# EAGLE design shield 1 axis (EAGLE 7.6.0)
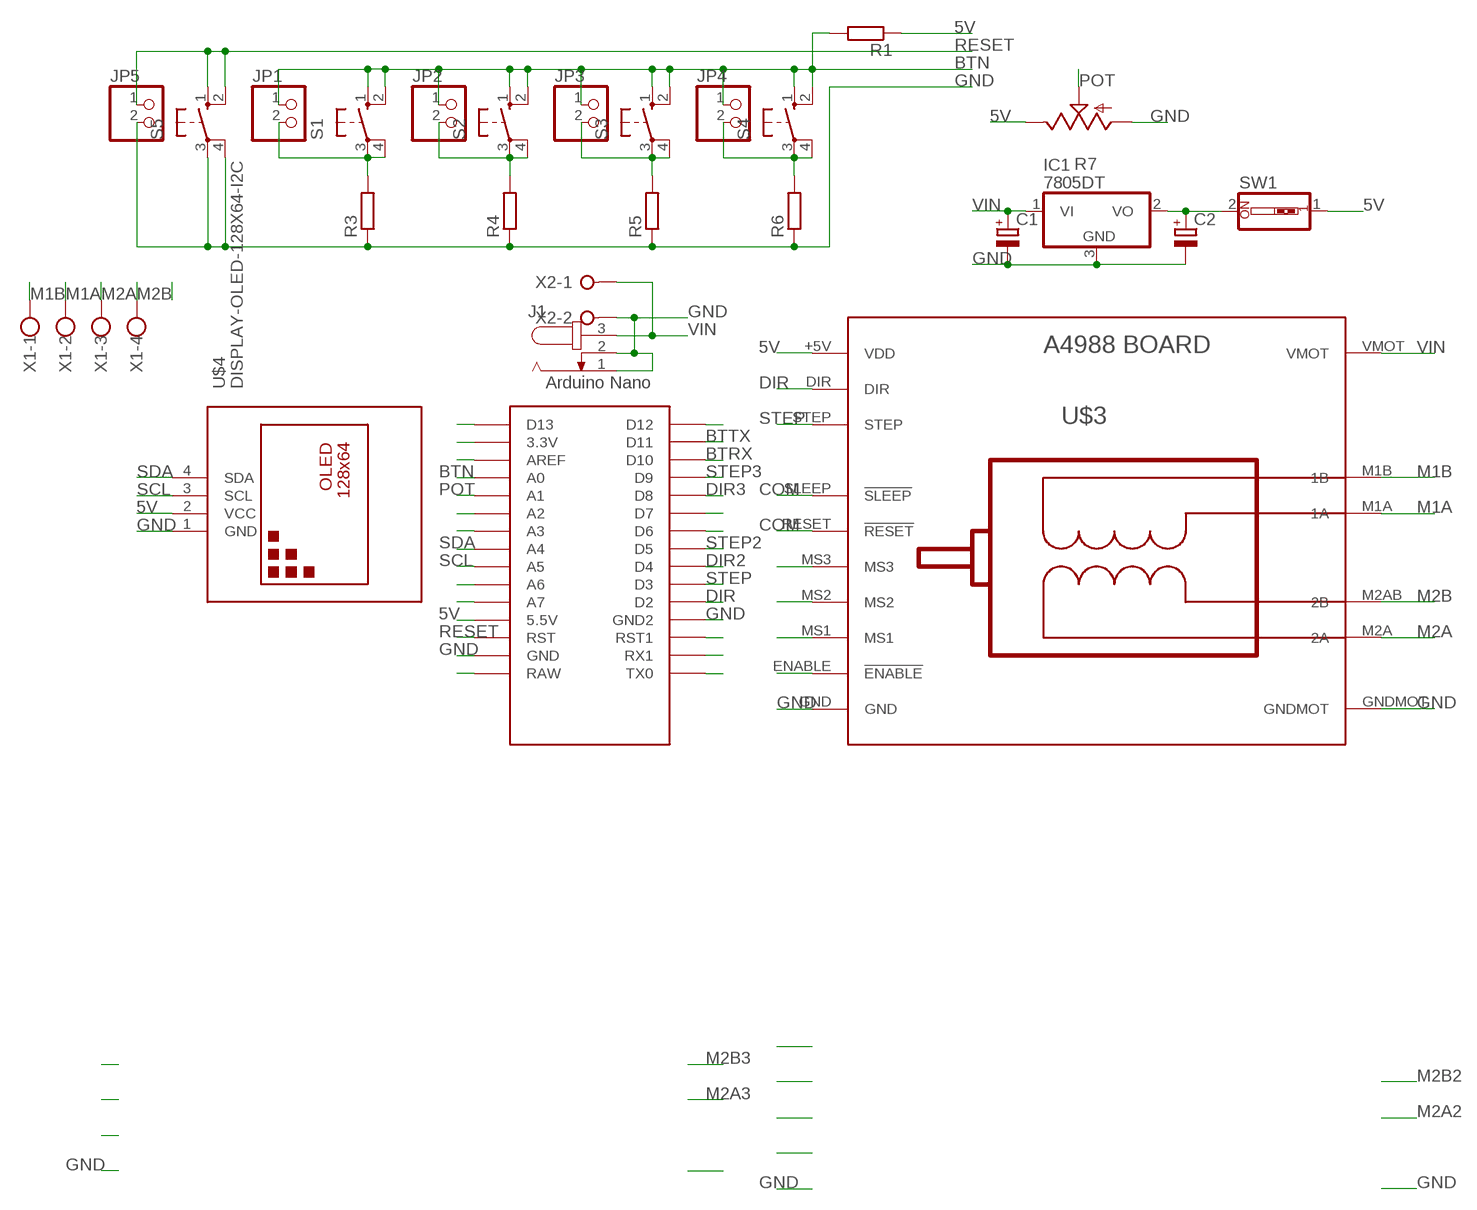
[diagram p0: schematic, sheet 1]

## Parts
C1  CPOL-EUE2.5-7  [E2,5-7]
C2  CPOL-EUE2.5-7  [E2,5-7]
IC1  7805DT  [TO252]
J1  JACK-PLUG1  [SPC4078]
JP1  PINHD-1X2  [1X02]
JP2  PINHD-1X2  [1X02]
JP3  PINHD-1X2  [1X02]
JP4  PINHD-1X2  [1X02]
JP5  PINHD-1X2  [1X02]
R1  R-EU_R1206  [R1206]
R3  R-EU_R1206  [R1206]
R4  R-EU_R1206  [R1206]
R5  R-EU_R1206  [R1206]
R6  R-EU_R1206  [R1206]
R7  TRIM_US-S63S  [S63S]
S1  40-XX  [B3F-40XX]
S2  40-XX  [B3F-40XX]
S3  40-XX  [B3F-40XX]
S4  40-XX  [B3F-40XX]
S5  10-XX  [B3F-10XX]
SW1  SW_DIP-1  [EDG-01]
U$1  NANO  [NANO]
U$3  BOARD_A4988  [BOARD_A4988]
U$4  DISPLAY-OLED-128X64-I2C  [DISPLAY-OLED-128X64-I2C]
X1  W237-4  [W237-4]
X2  W237-02P  [W237-132]

## Nets
5V: R1.1 R7.E SW1.1 U$1.5V(5.5V) U$3.+5V(VDD) U$4.2(VCC)
BTN: JP1.1 JP2.1 JP3.1 JP4.1 R1.2 S1.1(S) S1.2(S1) S2.1(S) S2.2(S1) S3.1(S) S3.2(S1) S4.1(S) S4.2(S1) U$1.A0
BTN1: JP4.2 R6.2 S4.3(P) S4.4(P1)
BTN2: JP3.2 R5.2 S3.3(P) S3.4(P1)
BTN3: JP2.2 R4.2 S2.3(P) S2.4(P1)
BTN4: JP1.2 R3.2 S1.3(P) S1.4(P1)
BTRX: U$1.D10
BTTX: U$1.D11
COM: U$3.RESET(!RESET) U$3.SLEEP(!SLEEP)
DIR: U$1.D2 U$3.DIR
DIR2: U$1.D4
DIR3: U$1.D8
GND: C1.- C2.- IC1.3(GND) J1.1 J1.2 JP5.2 R3.1 R4.1 R5.1 R6.1 R7.A S5.3(P) S5.4(P1) U$1.GND U$1.GND1(GND2) U$3.GND U$3.GNDMOT U$4.1(GND) X2.2
M1A: U$3.M1A(1A) X1.2
M1B: U$3.M1B(1B) X1.1
M2A: U$3.M2A(2A) X1.3
M2B: U$3.M2AB(2B) X1.4
N$4: U$1.D12
N$7: U$1.D6
N$10: U$1.RST1
N$11: U$1.TX0
N$14: U$1.A6
N$16: U$1.A2
N$18: U$1.3.3V
N$19: U$1.D13
N$25: U$3.MS2
N$26: U$3.ENABLE(!ENABLE)
N$42: U$1.AREF
N$44: U$1.A3
N$46: U$1.A7
N$48: U$1.RAW
N$49: U$1.RX1
N$53: U$1.D7
N$56: U$3.MS3
N$57: U$3.MS1
N$59: C2.+ IC1.2(VO) SW1.2
POT: R7.S U$1.A1
RESET: JP5.1 S5.1(S) S5.2(S1) U$1.RST
SCL: U$1.A5 U$4.3(SCL)
SDA: U$1.A4 U$4.4(SDA)
STEP: U$1.D3 U$3.STEP
STEP2: U$1.D5
STEP3: U$1.D9
VIN: C1.+ IC1.1(VI) J1.3 U$3.VMOT X2.1
Unconnected: U$1.ICSP1 U$1.ICSP2 U$1.ICSP3 U$1.ICSP4 U$1.ICSP5 U$1.ICSP6

## Library data of the parts
C1 C2 = Clean-Kong:CPOL-EU: POLARIZED CAPACITOR, European symbol
IC1 = adafruit:78*: Positive VOLTAGE REGULATOR Added bigger pads to the TO-92 package
J1 = con-jack:JACK-PLUG: DC POWER JACK Power Jack, DC, Right Angle, Through Hole, Rated 5A at 16VDC, PC Terminals Distributor: Farnell (www.Farnell.de) Drawing: 84N1161.pdf / 84N1162.pdf Manufacturer: SPC Technology (www.spctechnology.com) Type: SPC4077 / SPC 4078; OC_FARNELL: unknown; OC_NEWARK: unknown
JP1-JP5 = pinhead:PINHD-1X2: PIN HEADER
R1 R3-R6 = Clean-Kong:R-EU_: RESISTOR, European symbol
R7 = pot:TRIM_US-: POTENTIOMETER
S1-S4 = adafruit:40-XX: OMRON SWITCH; MF: OMRON COMPONENTS USA; MPN: B3F-4000; OC_FARNELL: 176434; OC_NEWARK: 36K3105
S5 = switch-omron:10-XX: OMRON SWITCH; MPN: B3F-1000; OC_FARNELL: 176432; OC_NEWARK: 36M3542
SW1 = special:SW_DIP-1: DIP SWITCH
U$1 = Arduino-clone:NANO: Arduino Nano
U$3 = Clean-Kong:BOARD_A4988
U$4 = diy-modules:DISPLAY-OLED-128X64-I2C: 128x64 Dot Matrix OLED Module based on SSD1306 chip Variant with I2C interface More details available here: http://www.instructables.com/id/Monochrome-096-i2c-OLED-display-with-arduino-SSD13/ SSD1306 datasheet: https://cdn-shop.adafruit.com/datasheets/SSD1306.pdf Click here to find device on ebay.com <http://www.ebay.com/sch/oled+display+128x64+iic> Note: There are two variants: I2C and SPI. Search for the proper version.
X1 = con-wago-500:W237-4: WAGO SCREW CLAMP; OC_FARNELL: unknown; OC_NEWARK: unknown
X2 = con-wago-508:W237-02P: WAGO SREW CLAMP; OC_FARNELL: unknown; OC_NEWARK: unknown

## Board
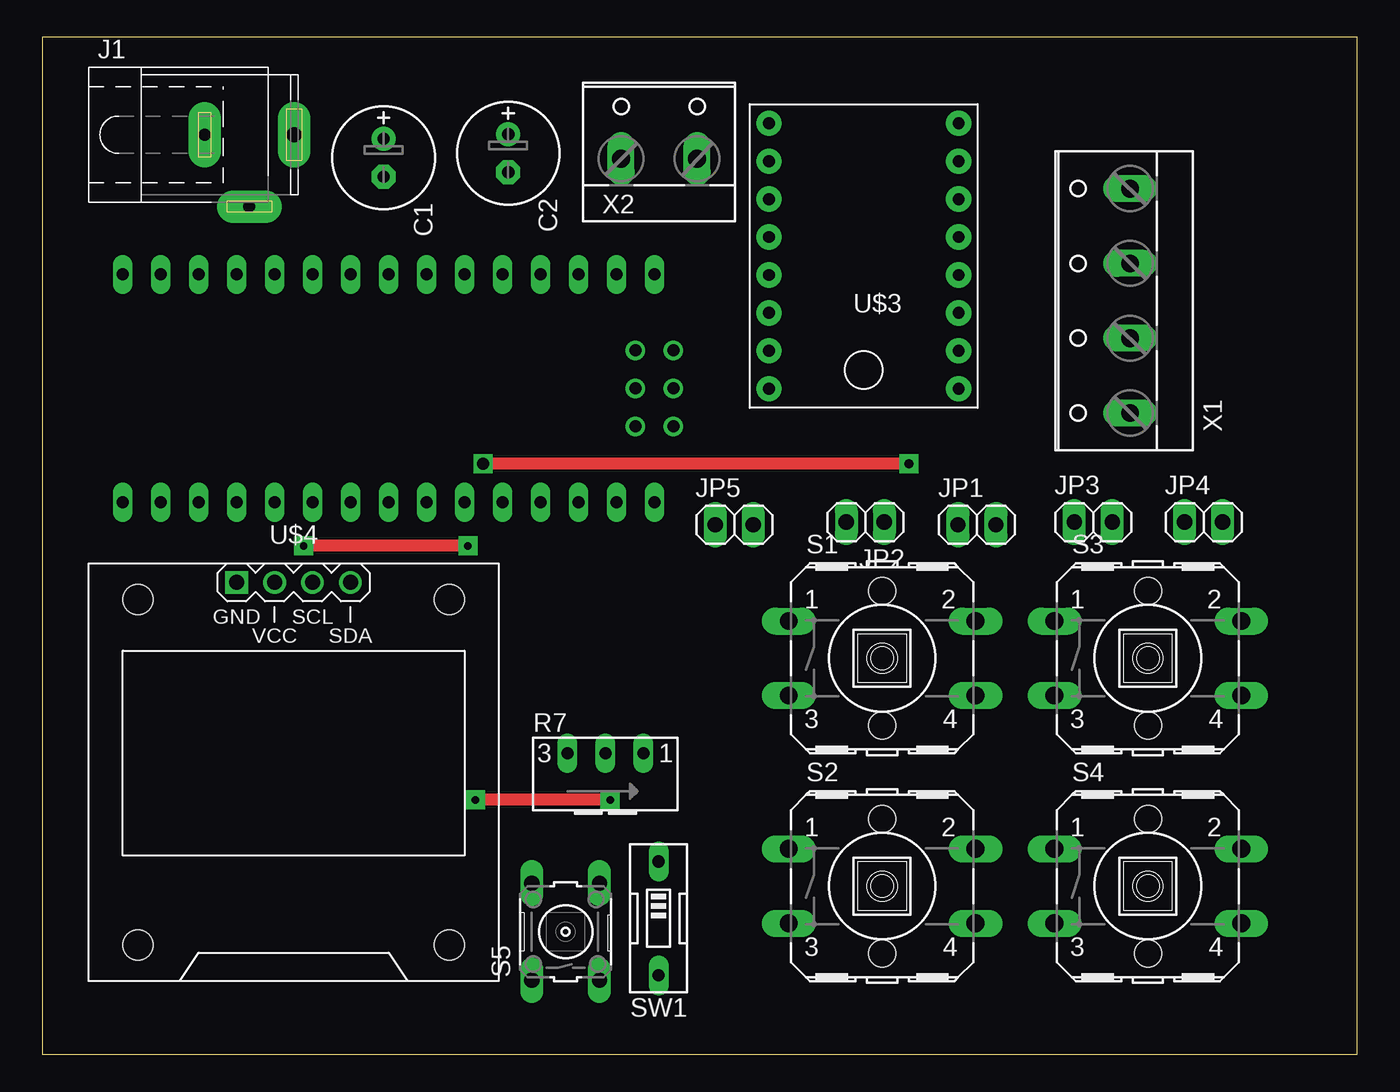
[diagram p1: board, top side]
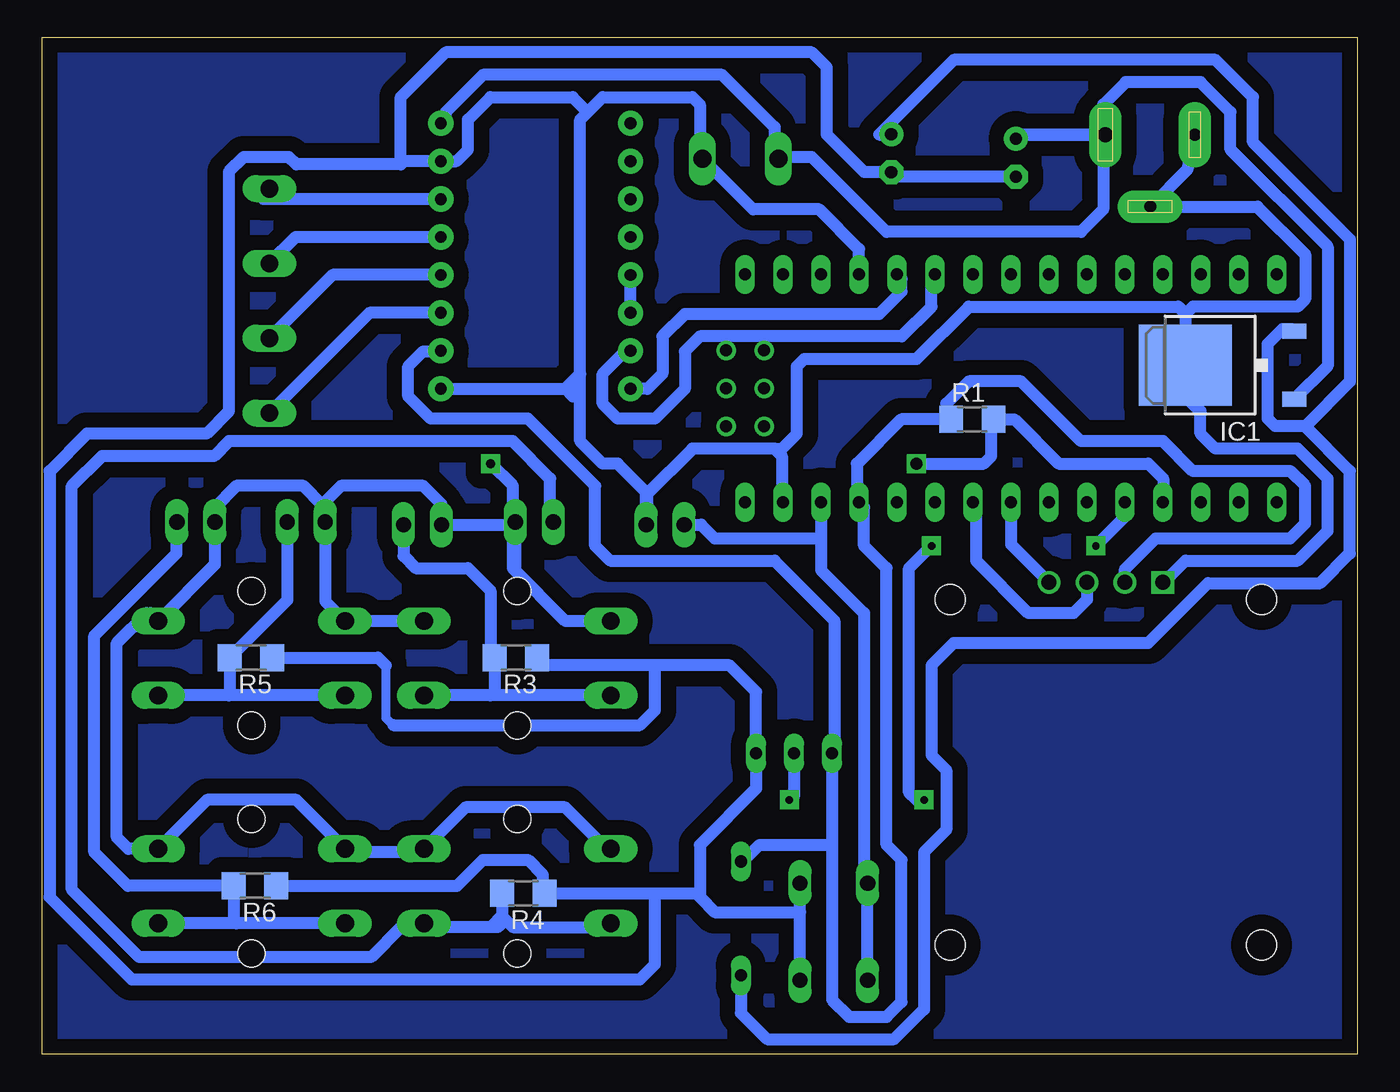
[diagram p2: board, bottom side, seen from below]

Size 88 x 68 mm. Coordinates in mm from the lower left corner, seen from the top.
Outline: 0,0 88,0 88,68 0,68 0,0
Copper layers (1*16): Top 0.035mm / dielectric 1.5mm / Bottom 0.035mm
Design rules "default": minimum track width 10mil, minimum drill 24mil, track to track 8mil, track to pad 8mil, pad to pad 8mil, via to via 8mil, smd to smd 8mil, copper to edge 40mil, drill to drill 8mil, minimum pad ring 10mil, minimum via ring 8mil, stop-mask expansion 4mil, vias tented up to drill 0mil, thermal gap 10mil

### Footprints (pad centres in the part's own frame; a part is rotated, then mirrored left to right if it is on the bottom)
E2,5-7 = drill 0.813 pad 1.6: + -1.27,0 | drill 0.813 pad 1.6 octagon: - 1.27,0
TO252 = smd 1 x 1.6: 1 -2.28,-4.8; 2 2.28,-4.8 | smd 5.4 x 6.2: 3 0,2.5
SPC4078 = drill 0.8 pad 2.184 long: 1 -3,0; 2 0,-4.8 | drill 1 pad 2.184 long: 3 3,0
1X02 = drill 1.016 long: 1 -1.27,0; 2 1.27,0
R1206 = smd 1.6 x 1.803: 1 -1.422,0; 2 1.422,0
S63S = drill 0.813 long: A 2.54,1.27; E -2.54,1.27; S 0,1.27
B3F-40XX = drill 1.194 long: 1 -6.248,2.489; 2 6.248,2.489; 3 -6.248,-2.489; 4 6.248,-2.489 | hole 1.803: 0,-4.496; 0,4.496
B3F-10XX = drill 1.016 long: 1 -3.251,2.261; 2 3.251,2.261; 3 -3.251,-2.261; 4 3.251,-2.261
EDG-01 = drill 0.813 long: 1 0,-3.81; 2 0,3.81
NANO = drill 0.8 long: 3.3V -10.16,24.13; 5V -10.16,-1.27; A0 -10.16,19.05; A1 -10.16,16.51; A2 -10.16,13.97; A3 -10.16,11.43; A4 -10.16,8.89; A5 -10.16,6.35; A6 -10.16,3.81; A7 -10.16,1.27; AREF -10.16,21.59; D2 5.08,1.27; D3 5.08,3.81; D4 5.08,6.35; D5 5.08,8.89; D6 5.08,11.43; D7 5.08,13.97; D8 5.08,16.51; D9 5.08,19.05; D10 5.08,21.59; D11 5.08,24.13; D12 5.08,26.67; D13 -10.16,26.67; GND -10.16,-6.35; GND1 5.08,-1.27; RAW -10.16,-8.89; RST -10.16,-3.81; RST1 5.08,-3.81; RX1 5.08,-6.35; TX0 5.08,-8.89 | drill 0.8: ICSP1 -5.08,-10.16; ICSP2 -5.08,-7.62; ICSP3 -2.54,-10.16; ICSP4 -2.54,-7.62; ICSP5 0,-10.16; ICSP6 0,-7.62
BOARD_A4988 = drill 0.8 pad 1.676: +5V 1.27,16.51; DIR 13.97,19.05; ENABLE 13.97,1.27; GND 1.27,19.05; GNDMOT 1.27,3.81; M1A 1.27,11.43; M1B 1.27,13.97; M2A 1.27,8.89; M2AB 1.27,6.35; MS1 13.97,3.81; MS2 13.97,6.35; MS3 13.97,8.89; RESET 13.97,11.43; SLEEP 13.97,13.97; STEP 13.97,16.51; VMOT 1.27,1.27
DISPLAY-OLED-128X64-I2C = drill 1 square: 1 -3.81,12.7 | drill 1: 2 -1.27,12.7; 3 1.27,12.7; 4 3.81,12.7 | hole 2: -10.414,11.557; 10.414,11.557; 10.414,-11.557; -10.414,-11.557
W237-4 = drill 1.194 long: 1 -7.5,-1.27; 2 -2.5,-1.27; 3 2.5,-1.27; 4 7.5,-1.27
W237-132 = drill 1.194 long: 1 -2.54,-0.635; 2 2.54,-0.635

### Placement (x,y rotation side)
C1  22.85,59.96 270 top
C2  31.19,60.26 270 top
IC1  9.02,46.08 90 bottom
J1  13.87,61.49 0 top
JP1  62.55,35.41 0 top
JP2  55.07,35.59 180 top
JP3  70.33,35.59 0 top
JP4  77.71,35.59 0 top
JP5  46.31,35.41 0 top
R1  25.76,42.46 0 bottom
R3  56.3,26.52 180 bottom
R4  55.8,10.76 180 bottom
R5  74.02,26.52 180 bottom
R6  73.75,11.26 180 bottom
R7  37.69,18.86 0 top
S1  56.2,26.48 0 top
S2  56.2,11.24 0 top
S3  73.98,26.48 0 top
S4  73.98,11.24 0 top
S5  35.03,8.19 90 top
SW1  41.25,9.08 180 top
U$1  32.07,47.07 90 top
U$3  62.59,63.54 180 top
U$4  16.83,18.86 0 top
X1  71.52,50.38 90 top
X2  41.28,60.52 0 top

### Tracks (layer width: path | path; a pad name or v marks a point on that pad's centre or on a via)
5V
  Bottom 0.813: U$4.2 15.56,32.44 13.5,34.5 4.5,34.5 3.5,35.5 3.5,38 4.5,39 11,39 13,41 18.5,41 22.5,45 26,45 27.5,43.5 27.5,42.78 R1.1 30.54,42.46 33.5,39.5 33.5,37.07 U$1.5V 33,36.57 33,34 31.5,32.5 31.5,14 30.5,13 30.5,3.5 31.5,2.5 34,2.5 35.15,3.65 35.15,14 | R7.E 35.15,18.99 | R7.E 35.15,14 | R7.E 35,20.28 35,29 39,33 50,33 51,34 51,38 55.5,42.5 62,42.5 63.5,44 63.5,46 62.5,47 61.35,47 U$3.+5V | SW1.1 41.11,12.89 40,14 35.15,14
BTN  (via drill 0.5 pad 1.27, 0.6, 0.8)
  Top 0.813: v58,39.5 v29.5,39.5
  Bottom 0.813: U$1.A0 13,36.93 13,38.5 14,39.5 20,39.5 22.96,42.46 R1.2 24.5,42.3 24.5,40 25,39.5 v29.5,39.5 | JP4.1 76.44,35 | 76.44,35 76.44,32.76 S3.2 80.76,29.5 81,29.5 83,27.5 83,14.5 82.23,13.73 S4.2 76.96,17 71,17 S4.1 67.5,13.5 63,13.5 62.77,13.73 S2.2 59.68,16.5 53,16.5 50.23,13.73 S2.1 | S3.1 69.06,30.3 JP3.1 69.06,36.56 69.25,36.75 | 69.25,36.75 70.5,38 75,38 76.5,36.5 76.5,35.06 76.44,35 | S1.2 S3.1 | 68.5,29 68.47,28.97 S3.1 | 69.25,36.75 68,38 62.5,38 61.28,36.78 JP1.1 56.52,35.41 JP2.1 56.34,32.34 53,29 49.98,29 S1.1 52.97,28.97 56.5,32.5 56.5,38 v58,39.5
BTN1
  Bottom 0.813: S4.3 75,8.75 | 75,8.75 S4.4 | 75,8.75 75.17,8.92 R6.2 82.26,11.26 84.5,13.5 84.5,28 79,33.5 79,35.57 JP4.2
BTN2
  Bottom 0.813: JP3.2 71.6,30.36 R5.2 75.44,24.05 75.5,23.99 | S3.3 75.5,23.99 | 75.5,23.99 S3.4
BTN3
  Bottom 0.813: R4.2 57.22,9.28 58,8.5 | 58,8.5 62.7,8.5 | 62.7,8.5 S2.4 | R4.2 57.22,9.22 56.5,8.5 49.7,8.5 | 49.5,8.5 49.7,8.5 | 49.7,8.5 S2.3 | R4.2 57.22,8.78 57.5,8.5 58,8.5 | 62.7,8.5 64,8.5 66,6.5 81.5,6.5 86,11 86,38 84,40 76.5,40 75.5,41 56.5,41 54,38.5 54,35.79 JP2.2
BTN4
  Bottom 0.813: S1.3 58,23.99 | 58,23.99 S1.4 | 58,23.99 57.72,24.27 R3.2 58,26.8 58,31 59.5,32.5 63,32.5 63.82,33.32 JP1.2
COM
  Bottom 0.813: U$3.SLEEP U$3.RESET
DIR
  Bottom 0.813: U$1.D2 30.5,51.85 30.5,51 32,49.5 45,49.5 46.5,48 46.5,45.5 47.5,44.5 U$3.DIR
GND
  Bottom 0.61: 65,26 65,22.5 64.5,22
  Bottom 0.813: J1.1 11.37,59.19 J1.2 6.69,56.69 3.5,53.5 3.5,50.5 4,50 11,50 11.5,49.5 | C1.- 30.89,58.69 C2.- 32.99,58.99 35.5,61.5 35.5,66 36.5,67 61,67 64,64 64,59.5 | U$1.GND1 33.34,53.84 36,56.5 40.44,56.5 X2.2 44,60.06 44,63.5 44.5,64 50.5,64 51.5,63 | U$1.GND 38.5,36.99 38.5,40 39,40.5 | 47.5,37.5 47.5,35.5 47.67,35.5 JP5.2 47.58,37.58 | 47.5,37.5 44.5,40.5 39,40.5 | U$4.1 12.94,31.56 11.5,33 4,33 2,35 2,38.5 4,40.5 9.5,40.5 10.5,41.5 10.5,43 12,44.5 12,44.6 IC1.3 11.5,45.1 11.5,49.5 | 39,40.5 38.5,40.5 37.5,41.5 37.5,46 37,46.5 29.5,46.5 26,50 12,50 11.5,49.5 | S5.3 37.29,9.5 | 37.29,9.5 S5.4 | 47,26 42,26 40.23,24.23 R7.A 40.23,17.77 44,14 44,10.5 | 47,26 54.36,26 R3.1 | 44,10.5 43,9.5 37.29,9.5 | 47,10.76 R4.1 54.5,10.88 54.5,12 55.5,13 58.5,13 60.24,11.26 R6.1 | 47,10.76 44.26,10.76 44,10.5 | 47.58,37.58 47.5,37.5 | R5.1 65.52,26.52 65,26 | 64.5,22 48,22 47,23 47,26 | 47.58,37.58 49.5,39.5 50.5,39.5 52,41 52,45.5 | 64,59.5 71,59.5 71.5,60 74.5,60 75.5,59 75.5,43 77,41.5 85,41.5 87.5,39 87.5,10.5 82,5 48,5 47,6 47,10.76 | 51.5,63 52.5,64 58,64 59.5,62.5 59.5,60.5 60.27,59.73 U$3.GNDMOT 63.77,59.73 64,59.5 | 52,45.5 52,62.5 51.5,63 | U$3.GND 52.99,44.49 | 52.99,44.49 52.5,44 | 52.99,44.49 53,44.5 52,45.5
M1A
  Bottom 0.813: U$3.M1A 68.56,52.11 X1.2
M1B
  Bottom 0.813: U$3.M1B 66.1,49.57 X1.1
M2A
  Bottom 0.813: U$3.M2A 71.02,54.65 X1.3
M2B
  Bottom 0.813: U$3.M2AB 73.19,57.19 73.5,57.5 73.17,57.5 X1.4
N$1
  pour Bottom (isolate 1.016): 0,68 88,68 88,0 0,0
N$59
  Bottom 0.813: C2.+ 31.22,61.5 32,61.5 27,66.5 9.5,66.5 7,64 7,61 0.5,54.5 0.5,45 3.5,42 | 3.5,42 5.5,42 6,42.5 6,47.5 5,48.5 4.36,48.5 IC1.2 | SW1.2 41.25,2.75 39.5,1 31,1 29,3 29,13.5 27.5,15 27.5,19 28.5,20 28.5,26 27,27.5 14,27.5 10,31.5 2.5,31.5 0.5,33.5 0.5,39 3.5,42
POT  (via drill 0.5 pad 1.27)
  Top 0.813: v38,17 v29,17 | v28.5,34 v17.5,34
  Bottom 0.813: R7.S 37.69,17.31 v38,17 | v29,17 29.5,17 30,17.5 30,32.5 v28.5,34 | v17.5,34 15.5,36 15.5,36.85 U$1.A1
RESET
  Bottom 0.813: U$1.RST 35.88,34.5 | 35.88,34.5 35.88,32.38 33,29.5 33,11.67 S5.2 S5.1 | JP5.1 43.91,35.41 43,34.5 35.88,34.5
SCL
  Bottom 0.813: U$4.3 18.1,30.4 19,29.5 22,29.5 25.5,33 25.5,36.69 U$1.A5
SDA
  Bottom 0.813: U$1.A4 23.18,34.1 U$4.4
STEP
  Bottom 0.813: U$1.D3 28.5,51.91 28.5,50 30.5,48 44,48 45,47 45,44.5 47,42.5 49.5,42.5 50.5,43.5 50.5,45.5 49,47 48.65,47 U$3.STEP
VIN
  Bottom 0.813: 22.61,60.99 C1.+ | C1.+ 22.59,61.49 J1.3 17,61.62 17,63.5 15.5,65 10.5,65 8.5,63 8.5,60.5 2,54 2,46.02 IC1.1 | C1.+ 22.77,61.23 22.5,61.5 17,61.5 17,56.5 18.5,55 31.5,55 36.5,60 38.62,60 X2.1 39,60.14 39,62 42.5,65.5 58.5,65.5 61,63 61,62.59 U$3.VMOT